# EAGLE design NeopixelRGBVisualizer-Single (EAGLE 9.2.0)
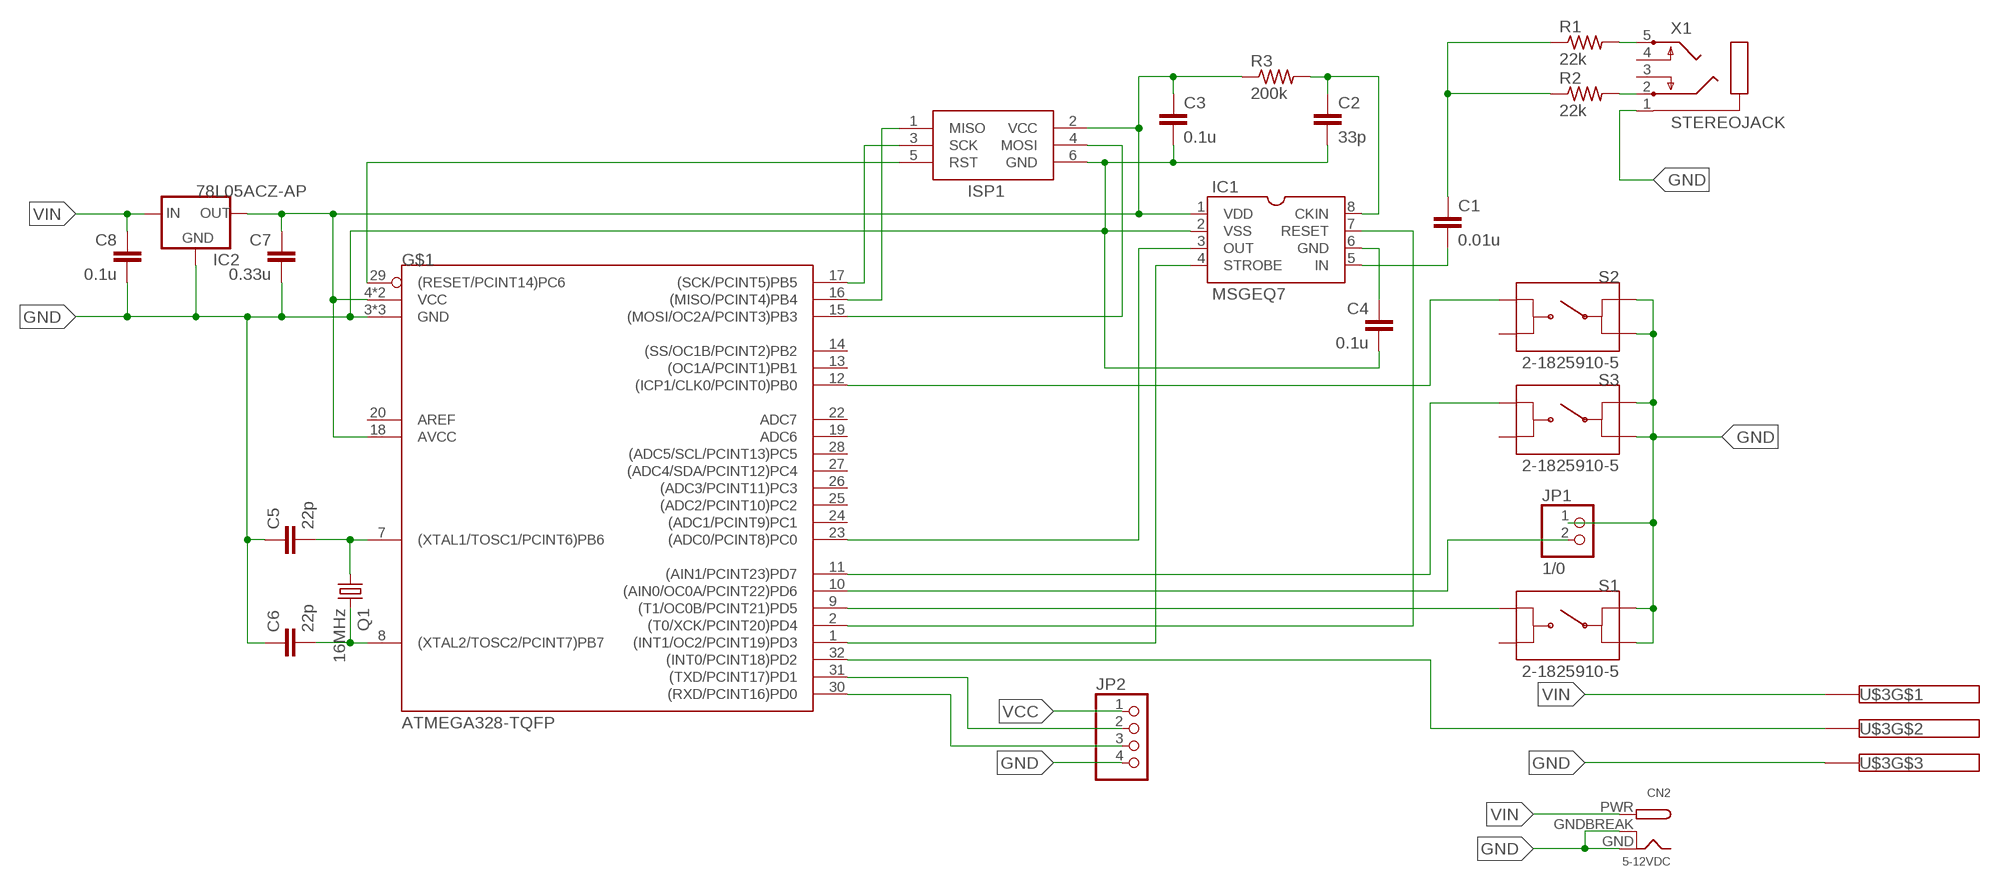
[diagram p0: schematic, sheet 1]

## Parts
C1  0.01u  C-EUC0805  [C0805]
C2  33p  C-EUC0805  [C0805]
C3  0.1u  C-EUC0805  [C0805]
C4  0.1u  C-EUC0805  [C0805]
C5  22p  C-EUC0805  [C0805]
C6  22p  C-EUC0805  [C0805]
C7  0.33u  C-EUC0805  [C0805]
C8  0.1u  C-EUC0805  [C0805]
CN2  5-12VDC  DCBARRELPTH  [DCJACK_2MM_PTH]
IC1  MSGEQ7  [DIL08]
IC2  78L05ACZ-AP  78LXX  [78LXX]
ISP1  AVRISP-6  [AVRISP]
JP1  1/0  PINHD-1X2/ROUND  [1X02-ROUND]
JP2  PINHD-1X4/OCT  [1X04-OCT]
Q1  16MHz  CRYSTALCTS406  [CTS406]
R1  22k  R-US_M0805  [M0805]
R2  22k  R-US_M0805  [M0805]
R3  200k  R-US_M0805  [M0805]
S1  2-1825910-5  [SW_2-1825910]
S2  2-1825910-5  [SW_2-1825910]
S3  2-1825910-5  [SW_2-1825910]
U$1  ATMEGA328-TQFP  [32M1-A]
U$3  0039303035  [4.2MM-3PIN]
X1  STEREOJACK  [STX3100]

## Nets
GND: C2.2 C3.2 C4.2 C5.1 C6.1 C7.2 C8.2 CN2.GND CN2.GNDBREAK IC1.2(VSS) IC2.GND ISP1.6(GND) JP1.1 JP2.4 S1.1 S1.3 S2.1 S2.3 S3.1 S3.3 U$1.3(GND) U$1.5(GND) U$1.21(GND) U$3.P$3 X1.1
MSGEQ7_OUT: IC1.3(OUT) U$1.23((ADC0/PCINT8)PC0)
MSGEQ7_RESET: IC1.7(RESET) U$1.2((T0/XCK/PCINT20)PD4)
MSGEQ7_STROBE: IC1.4(STROBE) U$1.1((INT1/OC2/PCINT19)PD3)
N$1: ISP1.3(SCK) U$1.17((SCK/PCINT5)PB5)
N$2: ISP1.5(RST) U$1.29((RESET/PCINT14)PC6)
N$3: ISP1.1(MISO) U$1.16((MISO/PCINT4)PB4)
N$4: ISP1.4(MOSI) U$1.15((MOSI/OC2A/PCINT3)PB3)
N$5: C4.1 IC1.6(GND)
N$8: S3.2 U$1.11((AIN1/PCINT23)PD7)
N$10: C1.2 IC1.5(IN)
N$11: R2.2 X1.2
N$12: C2.1 IC1.8(CKIN) R3.2
N$13: R1.2 X1.5
N$14: C5.2 Q1.1 U$1.7((XTAL1/TOSC1/PCINT6)PB6)
N$15: C6.2 Q1.3 U$1.8((XTAL2/TOSC2/PCINT7)PB7)
N$16: C1.1 R1.1 R2.1
N$17: U$1.32((INT0/PCINT18)PD2) U$3.P$2
N$18: S2.2 U$1.12((ICP1/CLK0/PCINT0)PB0)
N$19: JP1.2 U$1.10((AIN0/OC0A/PCINT22)PD6)
N$20: S1.2 U$1.9((T1/OC0B/PCINT21)PD5)
RX: JP2.3 U$1.30((RXD/PCINT16)PD0)
TX: JP2.2 U$1.31((TXD/PCINT17)PD1)
VCC: C3.1 C7.1 IC1.1(VDD) IC2.OUT ISP1.2(VCC) JP2.1 R3.1 U$1.4(VCC) U$1.6(VCC) U$1.18(AVCC)
VIN: C8.1 CN2.PWR IC2.IN U$3.P$1
Unconnected: S1.4 S2.4 S3.4 U$1.13((OC1A/PCINT1)PB1) U$1.14((SS/OC1B/PCINT2)PB2) U$1.19(ADC6) U$1.20(AREF) U$1.22(ADC7) U$1.24((ADC1/PCINT9)PC1) U$1.25((ADC2/PCINT10)PC2) U$1.26((ADC3/PCINT11)PC3) U$1.27((ADC4/SDA/PCINT12)PC4) U$1.28((ADC5/SCL/PCINT13)PC5) X1.3 X1.4

## Library data of the parts
C1-C8 = rcl:C-EU: CAPACITOR, European symbol; SPICEPREFIX: C
CN2 = adafruit:DCBARREL: 2.0mm DC Barrel Jack DCJACK_2MM_PTH - Through Hole Jack (4UConnector: 05537)
IC1 = mix-sig:MSGEQ7: Dual In Line / Socket
IC2 = v-reg:78LXX: VOLTAGE REGULATOR
ISP1 = adafruit:AVRISP: AVR ISP HEADER Standard 6 pin header for AVR programming
JP1 = mypinhead:PINHD-1X2: PIN HEADER
JP2 = mypinhead:PINHD-1X4: PIN HEADER
Q1 = adafruit:CRYSTAL: CRYSTAL; OC_FARNELL: unknown; OC_NEWARK: unknown
R1-R3 = rcl:R-US_: RESISTOR, American symbol; SPICEPREFIX: R
S1-S3 = te_tactileswitch:2-1825910-5: Switch Tactile OFF (ON) SPST Extended Round Button PC Pins 0.05A 24VDC 100000Cycle 1.57N Thru-Hole Loose Piece; DESCRIPTION: Switch Tactile OFF _ON_ SPST Extended Round Button PC Pins 0.05A 24VDC 100000Cycles 1.57N Thru-Hole Loose; DIGI-KEY_PART_NUMBER: 450-1644-ND; DIGI-KEY_PURCHASE_URL: https://www.digikey.com/product-detail/en/te-connectivity-alcoswitch-switches/3-1825910-5/450-1644-ND/1632530; EU_ROHS_COMPLIANCE: Compliant; LINK: http://www.te.com/usa-en/product-2-1825910-5.html; MF: TE Connectivity; MP: 2-1825910-5; PACKAGE: None
U$1 = ATMega:ATMEGA328-TQFP
U$3 = MinifitJR:0039303035: Molex Mini-Fit Jr 0039303035 CONN HEADER 3POS 4.2MM R/A TIN Connector Header Through Hole, Right Angle 3 position 0.165" (4.20mm) https://www.digikey.com/product-detail/en/molex-llc/0039303035/WM18446-ND/300079
X1 = adafruit:STEREOJACK: MIC/HEADPHONE JACK Stereo jack with two switches. Kycon STX3100, CUI SJ1-3555NG and/or 4UCon 05544

## Board
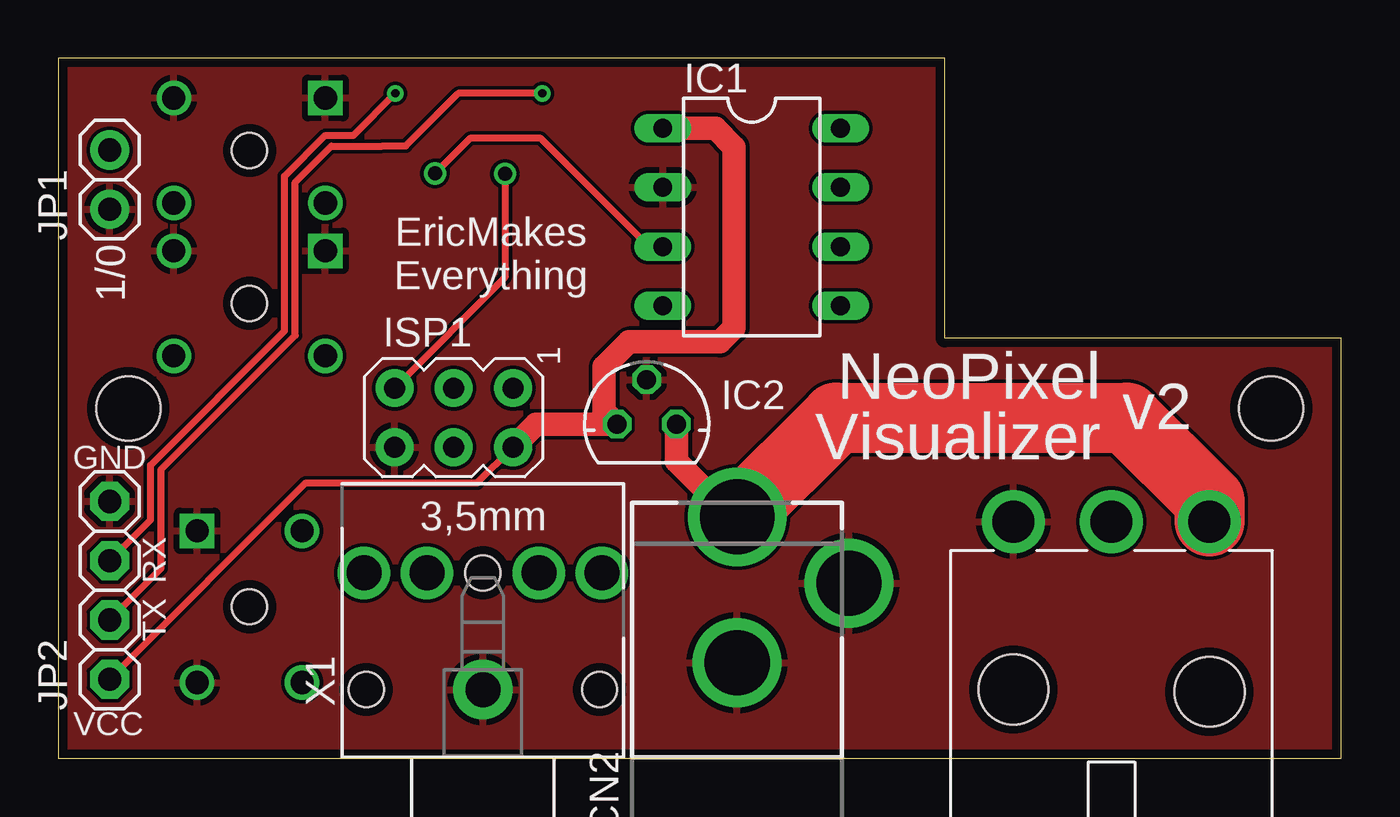
[diagram p1: board, top side]
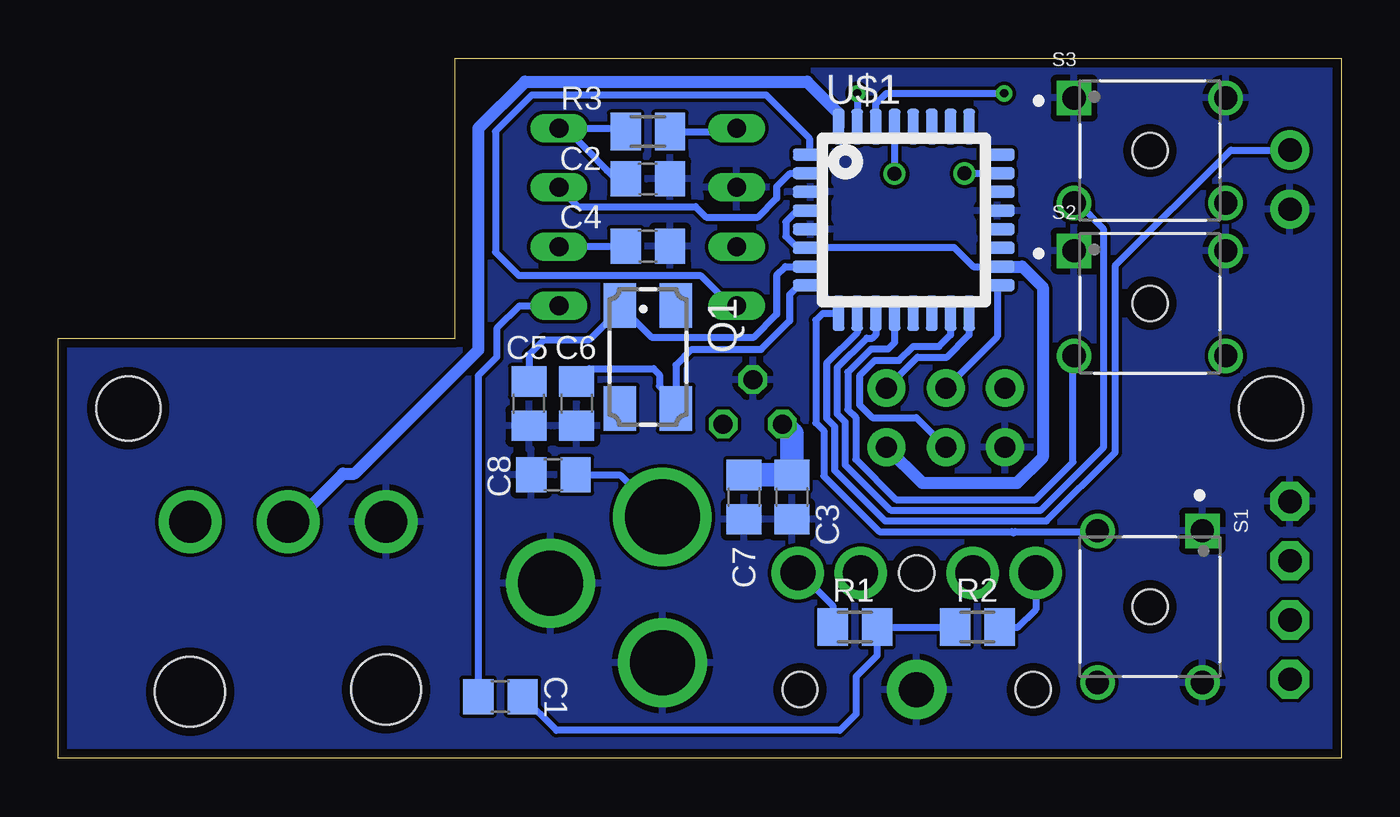
[diagram p2: board, bottom side, seen from below]

Size 55 x 30 mm. Coordinates in mm from the lower left corner, seen from the top.
Outline: 0,0 55,0 55,18 38,18 38,30 0,30 0,0
Copper layers (1*16): Top 0.0356mm / dielectric 1.5011mm / Bottom 0.0356mm
Design rules "oshpark-2layer": minimum track width 6mil, minimum drill 13mil, track to track 6mil, track to pad 6mil, pad to pad 6mil, via to via 6mil, smd to smd 6mil, copper to edge 15mil, drill to drill 6mil, minimum pad ring 7mil, minimum via ring 7mil, stop-mask expansion 2.5mil, vias tented up to drill 0mil, thermal gap 10mil
Holes 2.75 mm at 52,15 3,15
Holes 1.5 mm at 8.2,26.05 8.2,19.5 8.2,6.5

### Footprints (pad centres in the part's own frame; a part is rotated, then mirrored left to right if it is on the bottom)
C0805 = smd 1.3 x 1.5: 1 -0.95,0; 2 0.95,0
DCJACK_2MM_PTH = drill 2.8: GND 0,7.35; GNDBREAK 4.8,10.75 | drill 3.2: PWR 0,13.6
DIL08 = drill 0.813 long: 1 -3.81,-3.81; 2 -1.27,-3.81; 3 1.27,-3.81; 4 3.81,-3.81; 5 3.81,3.81; 6 1.27,3.81; 7 -1.27,3.81; 8 -3.81,3.81
78LXX = drill 0.813 octagon: GND 0,1.905; IN 1.27,0; OUT -1.27,0
AVRISP = drill 0.9 pad 1.626: 1 -1.27,2.54; 2 1.27,2.54; 3 -1.27,0; 4 1.27,0; 5 -1.27,-2.54; 6 1.27,-2.54
1X02-ROUND = drill 1 pad 1.676: 1 -1.27,0; 2 1.27,0
1X04-OCT = drill 1 pad 1.676 octagon: 1 -3.81,0; 2 -1.27,0; 3 1.27,0; 4 3.81,0
CTS406 = smd 1.9 x 1.4: 1 -2.2,-1.2; 2 2.2,-1.2; 3 2.2,1.2; 4 -2.2,1.2
M0805 = smd 1.3 x 1.6: 1 -0.95,0; 2 0.95,0
SW_2-1825910 = drill 0.99 square: 1 -3.25,2.25 | drill 0.99: 2 -3.25,-2.25; 3 3.25,2.25; 4 3.25,-2.25
32M1-A = smd 1.5 x 0.5: 1 -4,2.8; 2 -4,2; 3 -4,1.2; 4 -4,0.4; 5 -4,-0.4; 6 -4,-1.2; 7 -4,-2; 8 -4,-2.8; 17 4,-2.8; 18 4,-2; 19 4,-1.2; 20 4,-0.4; 21 4,0.4; 22 4,1.2; 23 4,2; 24 4,2.8 | smd 0.5 x 1.5: 9 -2.8,-4; 10 -2,-4; 11 -1.2,-4; 12 -0.4,-4; 13 0.4,-4; 14 1.2,-4; 15 2,-4; 16 2.8,-4; 25 2.8,4; 26 2,4; 27 1.2,4; 28 0.4,4; 29 -0.4,4; 30 -1.2,4; 31 -2,4; 32 -2.8,4
4.2MM-3PIN = drill 1.8: P$1 4.2,7.3; P$2 0,7.3; P$3 -4.2,7.3 | hole 3: -4.2,0.1; 4.2,0
STX3100 = drill 1.5 pad 2.54: 1 2.7,-0.1 | drill 1.5: 2 7.7,5; 3 7.7,2.3; 4 7.7,-2.5; 5 7.7,-5.2 | hole 1.5: 2.7,4.9; 2.7,-5.1; 7.7,-0.1

### Placement (x,y rotation side)
C1  36.05,2.65 180 bottom
C2  29.73,24.83 0 bottom
C3  23.55,11.2 270 bottom
C4  29.73,21.95 0 bottom
C5  34.83,15.2 90 bottom
C6  32.77,15.2 90 bottom
C7  25.6,11.2 270 bottom
C8  33.77,12.15 180 bottom
CN2  29.1,-3.25 0 top
IC1  29.73,23.2 270 top
IC2  25.23,14.32 0 top
ISP1  16.95,14.6 270 top
JP1  2.2,24.8 90 top
JP2  2.2,7.2 90 top
Q1  29.73,17.2 270 bottom
R1  20.85,5.62 180 bottom
R2  15.6,5.62 0 bottom
R3  29.73,26.86 180 bottom
S1  8.2,6.5 270 bottom
S2  8.2,19.5 0 bottom
S3  8.2,26.05 0 bottom
U$1  18.75,23.07 0 bottom
U$3  45.15,2.85 0 top
X1  18.1,0.25 90 top

### Tracks (layer width: path | path; a pad name or v marks a point on that pad's centre or on a via)
GND
  pour Top: 0,0 55,0 55,18 38,18 38,30 0,30
  pour Bottom: 0,30 0,0 55,0 55,18 38,18 38,30
MSGEQ7_OUT  (via drill 0.6)
  Top 0.305: v16.15,25.07 17.65,26.57 20.68,26.57 25.32,21.93 IC1.3
  Bottom 0.305: U$1.23 v16.14,25.07 v16.15,25.07
MSGEQ7_RESET
  Bottom 0.305: IC1.7 32.72,23.65 27.68,23.65 27.23,23.2 25,23.2 24.2,24 24.2,24.5 23.62,25.07 U$1.2
MSGEQ7_STROBE
  Bottom 0.305: IC1.4 26.16,19.39 27.48,20.7 35.27,20.7 36.26,21.69 36.26,26.87 34.7,28.43 24.66,28.43 22.8,26.57 22.8,25.88 U$1.1
N$1
  Bottom 0.305: ISP1.3 14.75,18.07 U$1.17
N$2  (via drill 0.6)
  Top 0.305: ISP1.5 19.15,20.61 v19.15,25.05
  Bottom 0.305: U$1.29 v19.15,25.05
N$3
  Bottom 0.305: ISP1.1 18.16,17.2 16.9,17.2 15.95,18.15 U$1.16
N$4
  Bottom 0.305: ISP1.4 18.22,14.6 20.1,14.6 20.65,15.15 20.65,16.39 19.99,17.05 18.96,17.05 18.35,17.66 17.24,17.66 16.75,18.15 U$1.15
N$5
  Bottom 0.305: IC1.6 33.52,21.95 C4.1
N$8
  Bottom 0.305: U$1.11 19.95,18.15 20.09,18.01 20.34,18.01 21.61,16.74 21.61,14.76 21.27,14.42 21.27,12.58 19.32,10.63 12.87,10.63 10.2,13.3 10.2,22.7 11.3,23.8 S3.2
N$10
  Bottom 0.305: IC1.5 35.23,19.39 36.2,18.43 36.2,17.2 37,16.4 C1.2
N$11
  Bottom 0.305: R2.2 13.85,5.62 13.1,6.38 X1.2
N$12
  Bottom 0.305: C2.1 31.11,24.83 31.48,25.2 33.23,27.01 | R3.2 30.82,27.01 33.23,27.01 | IC1.8 33.23,27.01
N$13
  Bottom 0.305: R1.2 21.8,6.55 23.2,7.95 X1.5
N$14
  Bottom 0.305: C5.2 34.83,17.3 34.17,17.95 32.23,17.95 30.93,19.25 Q1.1 29.57,18.05 25.18,18.05 24.2,19.02 24.2,20.7 23.82,21.07 U$1.7
N$15
  Bottom 0.305: C6.2 32.23,16.7 29.48,16.7 29.23,16.45 29.23,15.95 28.52,15.25 Q1.3 28.52,16.85 27.85,17.52 24.88,17.52 23.65,18.75 23.65,19.88 23.25,20.27 U$1.8
N$16
  Bottom 0.305: R2.1 R1.1 19.9,4.4 20.8,3.5 20.8,1.9 21.5,1.2 33.65,1.2 C1.1
N$17
  Bottom 0.508: U$1.32 21.55,27.65 22.9,29 35,29 37,27 37,17.5 42.3,12.2 42.8,12.2 44.85,10.15 U$3.P$2
N$18
  Bottom 0.305: U$1.12 19.15,17.82 19.42,17.55 20.15,17.55 21.15,16.55 21.15,14.95 20.81,14.61 20.81,12.82 19.08,11.09 13.11,11.09 11.5,12.7 11.5,17.2 S2.2
N$19
  Bottom 0.305: U$1.10 20.75,18.24 22.06,16.93 22.06,14.57 21.72,14.23 21.72,12.34 19.56,10.18 12.63,10.18 9.7,13.11 9.7,21.1 4.73,26.07 JP1.2
N$20
  Bottom 0.305: U$1.9 22.23,19.07 22.52,18.78 22.52,14.38 22.18,14.04 22.18,12.1 19.8,9.72 14.12,9.72 14.05,9.65 13.98,9.72 10.48,9.72 S1.2
RX  (via drill 0.35)
  Top 0.305: v14.45,28.5 12.65,26.7 11.45,26.7 9.7,24.95 9.7,18.32 3.95,12.57 3.95,10.22 JP2.3
  Bottom 0.305: U$1.30 19.95,28.05 19.5,28.5 v14.45,28.5
TX  (via drill 0.35)
  Top 0.305: v20.75,28.5 17.15,28.5 14.9,26.25 13.9,26.25 13.89,26.24 11.7,26.24 10.16,24.7 10.16,18.13 4.41,12.38 4.41,8.14 JP2.2
  Bottom 0.305: v20.75,28.5 U$1.31
VCC
  Top 0.305: JP2.1 10.61,11.8 17.96,11.8 ISP1.2
  Top 1: IC2.OUT 20.48,14.32 ISP1.2
  Top 1.016: IC1.1 28.16,27.01 28.98,26.2 28.98,18.45 28.38,17.85 24.48,17.85 23.4,16.77 23.4,14.88 IC2.OUT
  Bottom 0.305: IC1.1 26.07,26.86 R3.1 | U$1.4 23.32,23.48 23.8,23 23.8,22.37 23.31,21.88 U$1.6 22.73,21.9 16.6,21.9 15.78,21.07 U$1.18
  Bottom 0.508: U$1.18 13.68,21.07 12.8,20.2 12.8,12.9 13.9,11.8 17.96,11.8 ISP1.2
  Bottom 1: C7.1 C3.1 23.55,13.92 IC2.OUT
VIN
  Top 1.016: IC2.IN 26.5,12.72 28.87,10.35 CN2.PWR
  Top 3: U$3.P$1 49.35,11.05 45.8,14.6 33.35,14.6 CN2.PWR
  Bottom 0.305: C8.1 30.93,12.15 29.12,10.35 CN2.PWR

### Text on the board
tNames: EricMakes / Everything | NeoPixel / Visualizer | v2 | GND | RX | TX | VCC